# EAGLE design Rocketry_circuit (EAGLE 9.6.2)
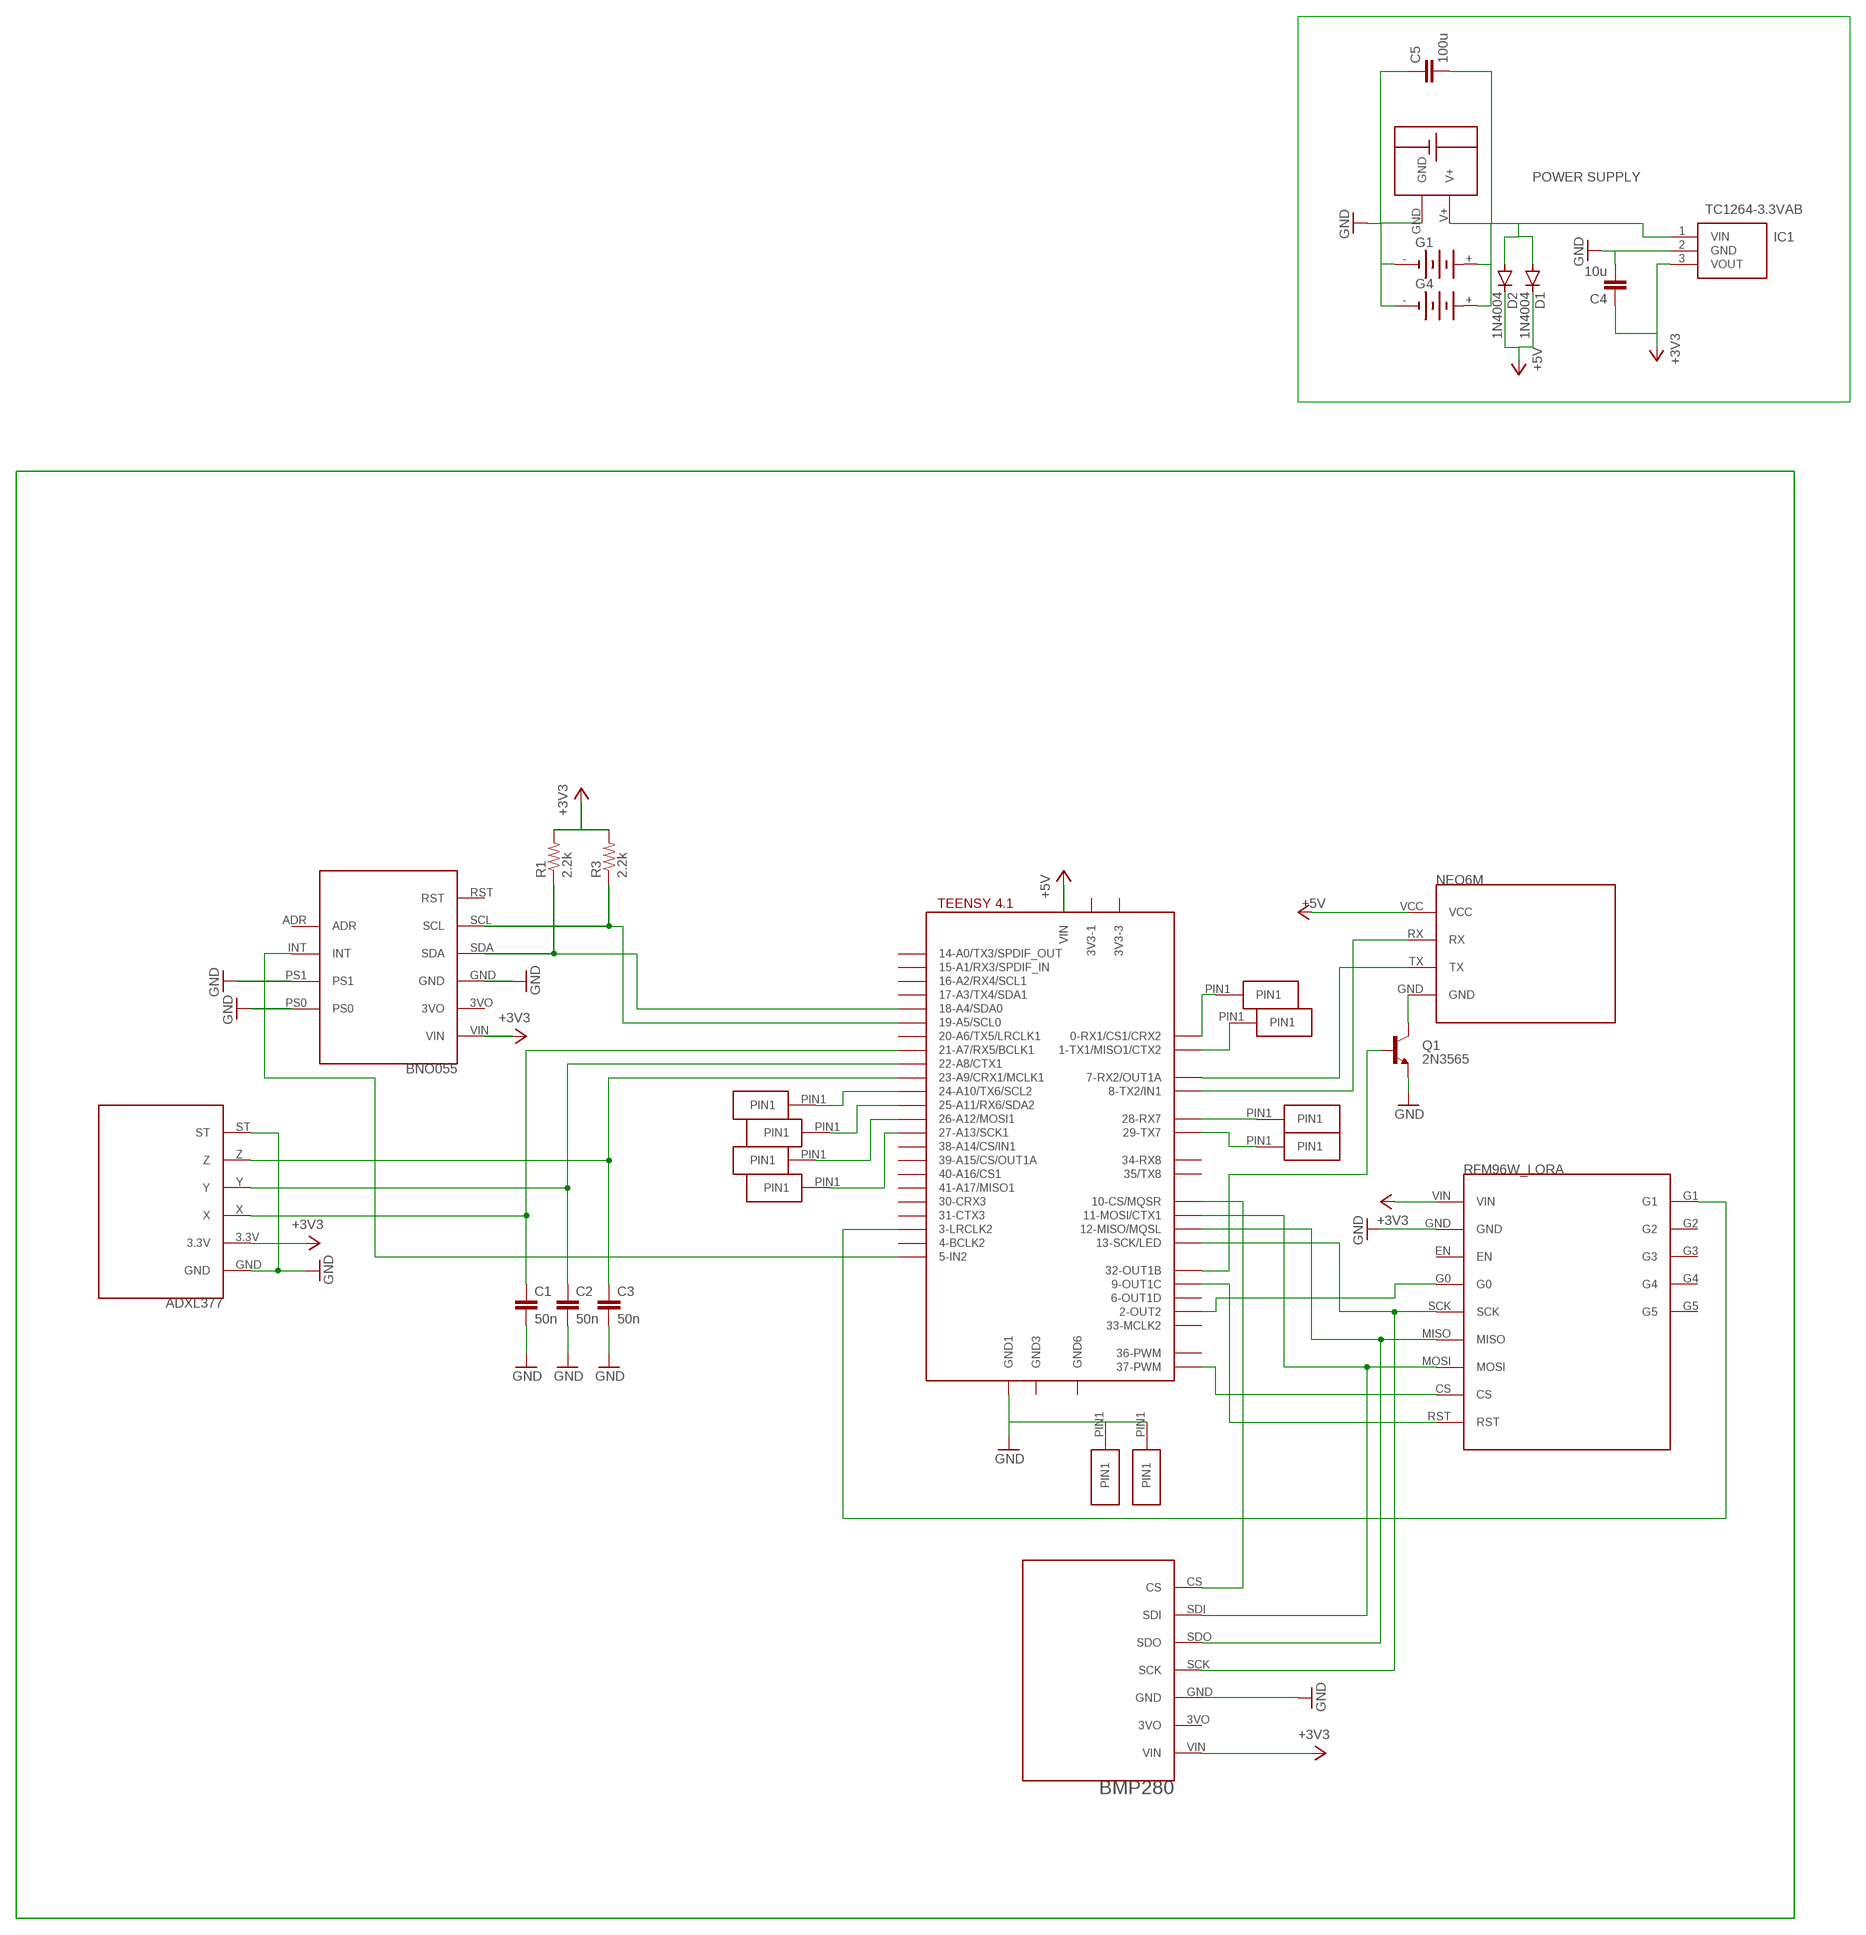
[diagram p0: schematic, sheet 1]

## Parts
BRKOUT1  BNO055  [BNO055]
C1  50n  C2,5-3  [C2.5-3]
C2  50n  C2,5-3  [C2.5-3]
C3  50n  C2,5-3  [C2.5-3]
C4  10u  C2,5-3  [C2.5-3]
C5  100u  C2,5-3  [C2.5-3]
D1  1N4004  [DO41-10]
D2  1N4004  [DO41-10]
G1  3V11R  [3V11R]
G4  3V11R  [3V11R]
IC1  TC1264-3.3VAB  [TO254P483X988X2222-3P]
Q1  2N3565  [TO92]
R1  2.2k  R-US_0207/5V  [0207/5V]
R3  2.2k  R-US_0207/5V  [0207/5V]
U$1  TEENSY41  [TEENSY41]
U$2  BMP280  [BMP280]
U$3  ADXL377  [ADXL377]
U$4  NEO6M  [NEO6M]
U$5  RFM96W  [RFM96W]
U$6  1PINOUT  [1PINOUT]
U$7  1PINOUT  [1PINOUT]
U$8  1PINOUT  [1PINOUT]
U$9  1PINOUT  [1PINOUT]
U$10  1PINOUT  [1PINOUT]
U$11  1PINOUT  [1PINOUT]
U$12  SMALL_SCREW_TERMINAL  [SMALL_SCREW_TERMINAL]
U$13  1PINOUT  [1PINOUT]
U$14  1PINOUT  [1PINOUT]
U$15  1PINOUT  [1PINOUT]
U$16  1PINOUT  [1PINOUT]

## Nets
+3V3: BRKOUT1.VIN C4.1 IC1.3(VOUT) R1.2 R3.2 U$2.VIN U$3.3.3V U$5.VIN
+5V: D1.C D2.C U$1.VIN U$4.VCC
GND: BRKOUT1.GND BRKOUT1.PS0 BRKOUT1.PS1 C1.2 C2.2 C3.2 C4.2 C5.1 G1.- G4.- IC1.2(GND) Q1.3(E) U$1.GND1 U$2.GND U$3.GND U$3.ST U$5.GND U$10.PIN1 U$11.PIN1 U$12.GND
N$1: C1.1 U$1.21-A7/RX5/BCLK1 U$3.X
N$2: C2.1 U$1.22-A8/CTX1 U$3.Y
N$3: BRKOUT1.SDA R1.1 U$1.18-A4/SDA0
N$4: C3.1 U$1.23-A9/CRX1/MCLK1 U$3.Z
N$5: BRKOUT1.SCL R3.1 U$1.19-A5/SCL0
N$6: U$1.7-RX2/OUT1A U$4.TX
N$7: U$1.8-TX2/IN2(8-TX2/IN1) U$4.RX
N$8: U$1.13-SCK/LED U$2.SCK U$5.SCK
N$9: U$1.12-MISO/MQSL U$2.SDO U$5.MISO
N$10: U$1.11-MOSI/CTX1 U$2.SDI U$5.MOSI
N$11: U$1.37-PWM U$5.CS
N$12: C5.2 D1.A D2.A G1.+ G4.+ IC1.1(VIN) U$12.V+
N$13: BRKOUT1.INT U$1.5-IN2
N$14: U$1.2-OUT2 U$5.G0
N$15: U$1.24-A10/TX6/SCL2 U$9.PIN1
N$16: U$1.10-CS\MQSR(10-CS/MQSR) U$2.CS
N$17: U$1.25-A11/RX6/SDA2 U$7.PIN1
N$18: U$1.28-RX7 U$6.PIN1
N$19: U$1.3-LRCLK2 U$5.G1
N$20: U$1.9-OUT1C U$5.RST
N$21: U$1.29-TX7 U$8.PIN1
N$22: U$1.26-A12/MOSI1 U$13.PIN1
N$23: Q1.2(B) U$1.32-OUT1B
N$24: Q1.1(C) U$4.GND
N$25: U$1.27-A13/SCK1 U$14.PIN1
N$26: U$1.0-RX1/CS1/CRX2 U$15.PIN1
N$27: U$1.1-TX1/MISO1/CTX2 U$16.PIN1
Unconnected: BRKOUT1.3VO BRKOUT1.ADR BRKOUT1.RST U$1.3V3-1 U$1.3V3-3 U$1.4-BCLK2 U$1.6-OUT1D U$1.14-A0/TX3/SPDIF_OUT U$1.15-A1/RX3/SPDIF_IN U$1.16-A2/RX4/SCL1 U$1.17-A3/TX4/SDA1 U$1.20-A6/TX5/LRCLK1 U$1.30-CRX3 U$1.31-CTX3 U$1.33-MCLK2 U$1.34-RX8 U$1.35-TX8(35/TX8) U$1.36-PWM U$1.38-A14/CS/IN1 U$1.39-A15/CS/OUT1A U$1.40-A16/CS1 U$1.41-A17/MISO1 U$1.GND3 U$1.GND6 U$2.3VO U$5.EN U$5.G2 U$5.G3 U$5.G4 U$5.G5

## Notes on the sheet
- POWER SUPPLY

## Library data of the parts
BRKOUT1 = BNO055:BNO055: A BNO055 breakout board by adafruit
C1-C5 = capacitor-wima:C: CAPACITOR naming: grid - package width
D1 D2 = diode:1N4004: DIODE general purpose rectifier, 1 A
G1 G4 = battery:3V11R: NC ACCU Varta
IC1 = TC1264-3.3VAB:TC1264-3.3VAB: LDO Regulator 3.3V 800mA Shutdown TO220 Microchip TC1264-3.3VAB, LDO Voltage Regulator, 800mA, 3.3 V +/-0.5%, 2.7 6 Vin, 3-Pin TO-220 Source: Datasheet <http://uk.rs-online.com/web/p/products/7747655>; ARROW_PART_NUMBER: TC1264-3.3VAB; ARROW_PRICE-STOCK: https://www.arrow.com/en/products/tc1264-3.3vab/microchip-technology; DESCRIPTION: LDO Regulator 3.3V 800mA Shutdown TO220 Microchip TC1264-3.3VAB, LDO Voltage Regulator, 800mA, 3.3 V +/-0.5%, 2.7 6 Vin, 3-Pin TO-220; HEIGHT: 4.826mm; MANUFACTURER_NAME: Microchip; MANUFACTURER_PART_NUMBER: TC1264-3.3VAB; MOUSER_PART_NUMBER: 579-TC1264-3.3VAB; MOUSER_PRICE-STOCK: https://www.mouser.co.uk/ProductDetail/Microchip-Technology/TC1264-33VAB?qs=Q7Ie0ohxq4vmR2G7dktayw%3D%3D
Q1 = transistor-npn:2N3565: NPN Transistor
R1 R3 = adafruit:R-US_: RESISTOR, American symbol
U$1 = teensy:TEENSY41
U$2 = BMP280:BMP280
U$3 = ADXL377:ADXL377
U$4 = NEO6M:NEO6M
U$5 = RMF96W_lora:RFM96W
U$6-U$11 U$13-U$16 = 1PINOUT:1PINOUT
U$12 = SMALL_SCREW_TERMINAL:SMALL_SCREW_TERMINAL

## Board
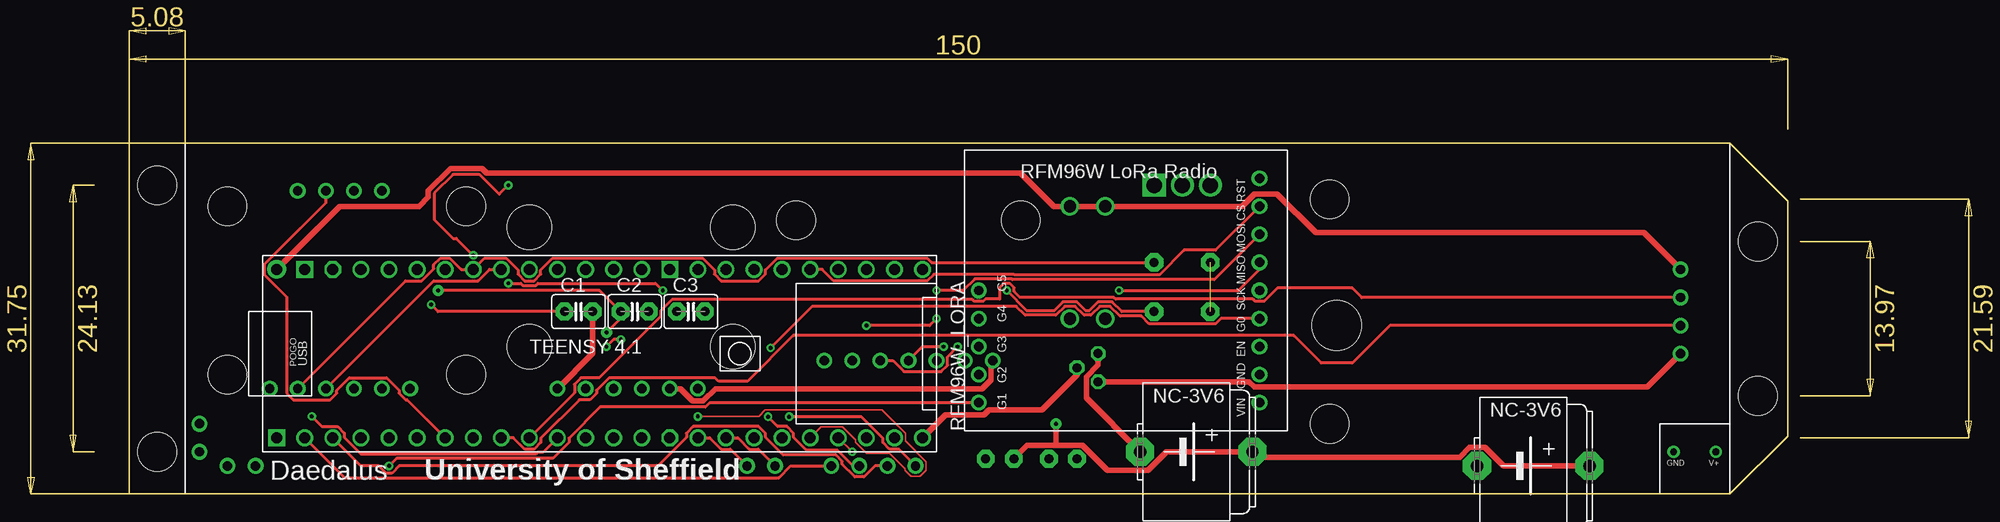
[diagram p1: board, top side]
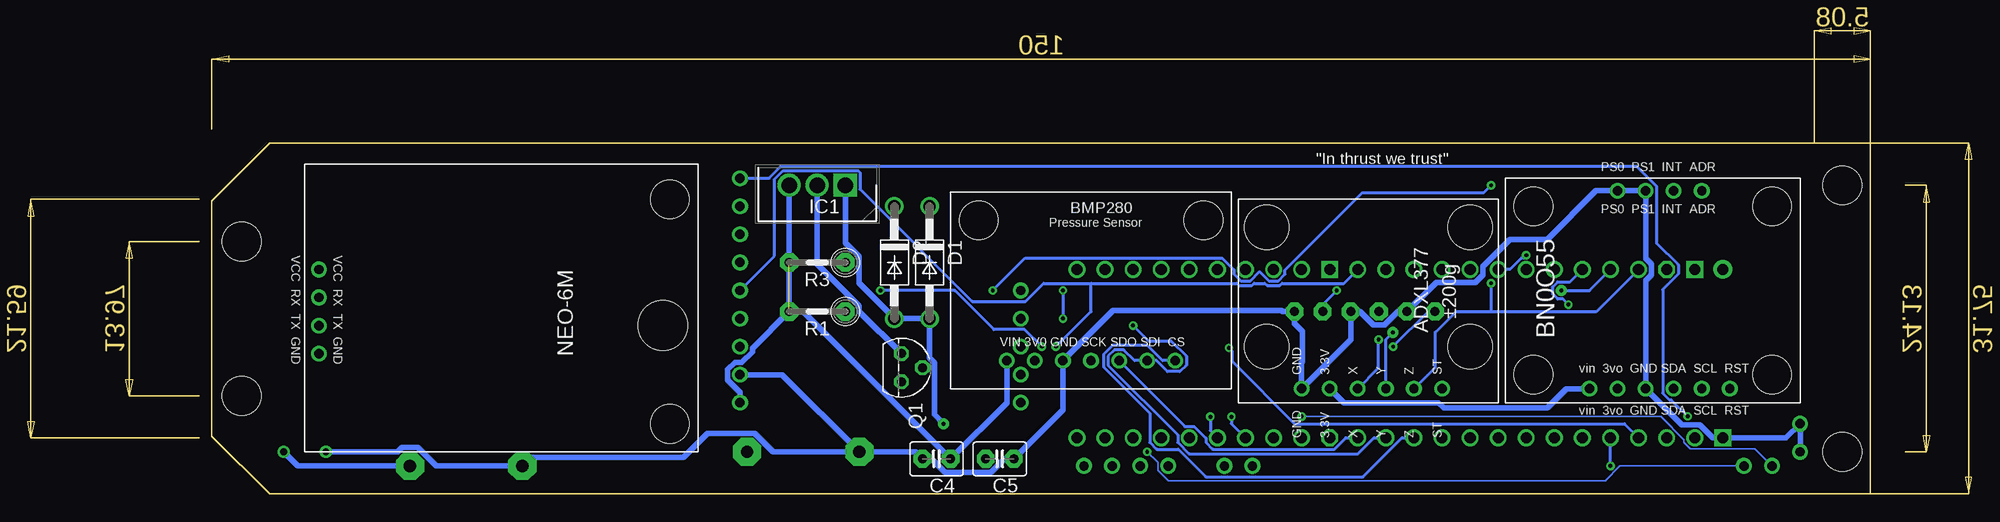
[diagram p2: board, bottom side, seen from below]

Size 150 x 31.75 mm. Coordinates in mm from the lower left corner, seen from the top.
Outline: 0,0 0,31.75 144.78,31.75 150,26.53 150,5.22 144.78,0 0,0
Copper layers (1*16): Top 0.035mm / dielectric 1.5mm / Bottom 0.035mm
Design rules "default": minimum track width 6mil, minimum drill 0.35mm, track to track 6mil, track to pad 6mil, pad to pad 6mil, via to via 6mil, smd to smd 6mil, copper to edge 40mil, drill to drill 6mil, minimum pad ring 10mil, minimum via ring 8mil, stop-mask expansion 4mil, vias tented up to drill 0mil, thermal gap 10mil
Holes 3.5 mm at 2.54,27.94 2.54,3.81 147.32,22.86 147.32,8.89

### Footprints (pad centres in the part's own frame; a part is rotated, then mirrored left to right if it is on the bottom)
BNO055 = drill 0.85 pad 1.422: 3VO 1.27,16.51; ADR 19.19,8.89; GND 1.27,13.97; INT 19.19,11.43; PS0 19.19,16.51; PS1 19.19,13.97; RST 1.27,6.35; SCL 1.27,8.89; SDA 1.27,11.43; VIN 1.27,19.05 | hole 3.5: 2.54,24.13; 17.78,24.13; 2.54,2.54; 17.78,2.54
C2.5-3 = drill 0.813 pad 1.6 octagon: 1 -1.27,0; 2 1.27,0
DO41-10 = drill 1.118: A 5.08,0; C -5.08,0
3V11R = drill 1.118 pad 2.54 octagon: + -5.08,0; - 5.08,0
TO254P483X988X2222-3P = drill 1.39 pad 2.085 square: 1 0,0 | drill 1.39 pad 2.085: 2 2.54,0; 3 5.08,0
TO92 = drill 0.813 octagon: 1 1.27,0; 2 0,1.905; 3 -1.27,0
0207/5V = drill 0.813 pad 1.676 octagon: 1 -2.54,0; 2 2.54,0
TEENSY41 = drill 1: 0-RX1/CS1/CRX2 -27.94,-7.62; 1-TX1/MISO1/CTX2 -25.4,-7.62; 2-OUT2 -22.86,-7.62; 3-LRCLK2 -20.32,-7.62; 4-BCLK2 -17.78,-7.62; 5-IN2 -15.24,-7.62; 6-OUT1D -12.7,-7.62; 7-RX2/OUT1A -10.16,-7.62; 8-TX2/IN2 -7.62,-7.62; 9-OUT1C -5.08,-7.62; 10-CS\MQSR -2.54,-7.62; 11-MOSI/CTX1 0,-7.62; 12-MISO/MQSL 2.54,-7.62; 13-SCK/LED 2.54,7.62; 14-A0/TX3/SPDIF_OUT 0,7.62; 15-A1/RX3/SPDIF_IN -2.54,7.62; 16-A2/RX4/SCL1 -5.08,7.62; 17-A3/TX4/SDA1 -7.62,7.62; 18-A4/SDA0 -10.16,7.62; 19-A5/SCL0 -12.7,7.62; 20-A6/TX5/LRCLK1 -15.24,7.62; 21-A7/RX5/BCLK1 -17.78,7.62; 22-A8/CTX1 -20.32,7.62; 23-A9/CRX1/MCLK1 -22.86,7.62; 24-A10/TX6/SCL2 7.62,-7.62; 25-A11/RX6/SDA2 10.16,-7.62; 26-A12/MOSI1 12.7,-7.62; 27-A13/SCK1 15.24,-7.62; 28-RX7 17.78,-7.62; 29-TX7 20.32,-7.62; 30-CRX3 22.86,-7.62; 31-CTX3 25.4,-7.62; 32-OUT1B 27.94,-7.62; 33-MCLK2 27.94,7.62; 34-RX8 25.4,7.62; 35-TX8 22.86,7.62; 36-PWM 20.32,7.62; 37-PWM 17.78,7.62; 38-A14/CS/IN1 15.24,7.62; 39-A15/CS/OUT1A 12.7,7.62; 40-A16/CS1 10.16,7.62; 41-A17/MISO1 7.62,7.62 | drill 1 octagon: 3V3-1 5.08,-7.62; 3V3-3 -25.4,7.62 | drill 1 square: GND1 -30.48,-7.62; GND3 5.08,7.62; GND6 -27.94,7.62 | drill 1 pad 1.676: VIN -30.48,7.62
BMP280 = drill 0.85 pad 1.422: 3VO 2.54,17.78; CS 2.54,5.08; GND 2.54,15.24; SCK 2.54,12.7; SDI 2.54,7.62; SDO 2.54,10.16; VIN 2.54,20.32 | hole 3.5: 15.24,22.86; 15.24,2.54
ADXL377 = drill 0.85 pad 1.422: 3.3V 1.27,15.24; GND 1.27,17.78; ST 1.27,5.08; X 1.27,12.7; Y 1.27,10.16; Z 1.27,7.62 | hole 4: 5.08,20.955; 15.875,20.955; 15.875,2.54; 5.08,2.54
NEO6M = drill 0.85 pad 1.422: GND 1.27,8.89; RX 1.27,13.97; TX 1.27,11.43; VCC 1.27,16.51 | hole 3.5: 33.02,2.54; 33.02,22.86 | hole 4.5: 32.385,11.43
RFM96W = drill 0.85 pad 1.422: CS 20.32,2.54; EN 7.62,2.54; G0 10.16,2.54; G1 2.54,27.94; G2 5.08,27.94; G3 7.62,27.94; G4 10.16,27.94; G5 12.7,27.94; GND 5.08,2.54; MISO 15.24,2.54; MOSI 17.78,2.54; RST 22.86,2.54; SCK 12.7,2.54; VIN 2.54,2.54
1PINOUT = drill 0.85 pad 1.422: PIN1 0,0
SMALL_SCREW_TERMINAL = drill 0.6: GND 1.27,3.81; V+ 5.08,3.81

### Placement (x,y rotation side)
BRKOUT1  6.35,8.26 90 bottom
C1  40.64,16.51 0 top
C2  45.72,16.51 0 top
C3  50.8,16.51 0 top
C4  84.45,3.17 180 bottom
C5  78.74,3.17 180 bottom
D1  85.09,20.95 270 bottom
D2  88.27,20.95 270 bottom
G1  127,2.54 180 top
G4  96.52,3.81 180 top
IC1  92.71,27.94 180 bottom
Q1  87.63,11.43 270 bottom
R1  95.25,16.51 180 bottom
R3  95.25,20.95 180 bottom
U$1  43.81,12.7 0 top
U$2  57.78,9.53 90 bottom
U$3  33.66,8.26 90 bottom
U$4  141.6,3.81 0 bottom
U$5  104.78,5.71 90 top
U$6  8.89,2.54 0 top
U$7  58.42,2.54 0 top
U$8  11.43,2.54 0 top
U$9  55.88,2.54 0 top
U$10  6.35,3.81 0 top
U$11  6.35,6.35 0 top
U$12  138.43,0 0 top
U$13  66.04,2.54 0 top
U$14  71.12,2.54 0 top
U$15  63.5,2.54 0 top
U$16  68.58,2.54 0 top

### Tracks (layer width: path | path; a pad name or v marks a point on that pad's centre or on a via)
+3V3  (1 unrouted)
  Top 0.508: U$2.VIN 77.95,11.91 77.95,10.33 77.15,9.53 53.02,9.53 51.9,8.41 50.97,8.41 49.85,9.53 U$3.3.3V
  Bottom 0.508: IC1.3 R1.2 | R1.2 101.12,13.18 101.12,12.87 102.08,11.91 102.7,11.91 103.35,11.26 103.35,10.33 102.23,9.21 U$5.VIN | U$2.VIN 78.11,8.26 C4.1 96.52,16.51 R1.2 | BRKOUT1.VIN 27.48,9.53 29.23,7.78 38.57,7.78 39.05,8.26 47.62,8.26 U$3.3.3V
+5V
  Top 0.508: U$4.VCC 137,23.65 107.33,23.65 103.83,27.15 101.77,27.15 100.65,26.04 D2.C D1.C 83.65,26.04 80.63,29.05 32.31,29.05 31.9,29.46 29.06,29.46 27.05,27.45 27.05,26.88 26.21,26.04 19.05,26.04 U$1.VIN
GND
  Top 0.508: Q1.3 87.63,11.67 86.56,10.6 86.56,8.69 G4.- | C1.2 41.91,12.7 U$3.ST
  Bottom 0.508: Q1.3 91.47,16.54 91.47,17.03 95.25,20.81 IC1.2 | G4.- 98.42,10.79 U$5.GND | G4.- 99.23,3.81 100.91,5.49 105.18,5.49 107.33,3.33 121.13,3.33 G1.- 129.71,2.54 131.39,4.22 132.77,4.22 133.18,3.81 U$12.GND | U$10.PIN1 U$11.PIN1 7.62,5.08 U$1.GND1 14.23,5.08 15.39,6.24 17.04,6.24 BRKOUT1.GND 20.32,19.31 19.8,19.84 19.8,20.8 20.32,21.33 BRKOUT1.PS1 BRKOUT1.PS0 24.8,27.45 29.23,23.02 32.6,23.02 35.03,20.58 35.03,19.84 35.71,19.16 39.26,19.16 C1.2 42.74,16.51 43.95,15.3 44.95,15.3 46.16,16.51 C2.2 46.99,13.97 U$3.GND 51.44,11.89 51.34,11.98 51.34,14.69 52.07,15.42 C3.2 53.16,16.51 53.26,16.61 68.48,16.61 U$2.GND 73.03,7.62 C5.1 78.3,3.17 79.51,1.97 83.69,1.97 84.89,3.17 C4.2 86.36,3.81 G4.-
N$1  (via drill 0.35 pad 0.75)
  Top 0.254: v44.47,13.97 43.79,13.97 v43.16,13.34 | C1.1 27.94,16.51 v27.3,17.14
  Bottom 0.254: U$3.X 44.47,11.41 v44.47,13.97 | v43.16,13.34 39.98,16.51 C1.1 | U$1.21-A7/RX5/BCLK1 27.16,19.19 28.26,19.19 28.72,18.74 28.72,18.09 28.26,17.64 27.8,17.64 v27.3,17.14
N$2  (via drill 0.35 pad 1)
  Top 0.254: v43.18,14.61 44.45,15.88 C2.1 42.55,18.41 v27.94,18.41
  Bottom 0.254: U$3.Y 43.81,13.97 v43.18,14.61 | v27.94,18.41 25.4,18.41 U$1.22-A8/CTX1
N$3  (via drill 0.35 pad 0.75)
  Top 0.254: BRKOUT1.SDA 27.54,19.29 31.54,19.29 32.58,20.32 U$1.18-A4/SDA0 | v79.38,18.41 81.2,16.59 83.65,16.59 84.46,17.4 85.72,17.4 86.53,16.59 86.82,16.59 87.63,17.4 88.9,17.4 89.78,16.51 R1.1 | v34.29,27.94 33.48,27.13 31.68,28.93 29.28,28.93 27.59,27.23 27.59,24.84 29.28,23.14 29.58,23.14 v31.11,21.61
  Bottom 0.254: v79.38,18.41 76.44,21.35 58.63,21.35 57.55,20.27 57.55,19.89 56.94,19.29 56.09,19.29 55.24,20.13 54.4,19.29 53.55,19.29 52.94,19.89 52.94,20.27 45.94,27.27 34.96,27.27 v34.29,27.94 | v31.11,21.61 31.37,21.35 31.54,21.35 32.58,20.32 U$1.18-A4/SDA0
N$4  (via drill 0.35 pad 0.75)
  Top 0.254: v48.26,18.41 47.6,19.07 36.98,19.07 36.79,18.88 35.6,18.88 35.41,19.07 v34.29,19.07
  Bottom 0.254: U$1.23-A9/CRX1/MCLK1 24.8,16.48 34.29,16.48 | 34.29,16.48 37.5,16.48 39.34,14.64 39.34,11.46 U$3.Z | 34.29,16.48 v34.29,19.07 | v48.26,18.41 49.53,17.14 C3.1
N$5
  Top 0.254: BRKOUT1.SCL 25,19.29 26.46,19.29 27.54,20.36 27.54,20.75 28.15,21.35 29,21.35 30.04,20.32 U$1.19-A5/SCL0 32.15,21.35 34.08,21.35 35.16,20.27 35.16,19.89 35.77,19.29 36.62,19.29 37.23,19.89 37.23,20.27 38.31,21.35 51.86,21.35 52.94,20.27 52.94,19.89 53.55,19.29 56.94,19.29 57.55,19.89 57.55,20.27 58.63,21.35 72.18,21.35 72.58,20.95 R3.1
N$6
  Top 0.254: U$4.TX 114.02,15.24 110.62,11.85 107.81,11.85 105.34,14.33 60.05,14.33 55.91,10.19 53.31,10.19 52.98,10.52 43.41,10.52 42.27,9.38 42.27,9.12 41.69,8.53 40.73,8.53 37.23,5.04 37.23,4.65 36.62,4.05 35.77,4.05 34.73,5.08 U$1.7-RX2/OUT1A
N$7
  Top 0.254: U$4.RX 111.48,17.78 110.62,18.63 103.85,18.63 102.64,17.42 101.83,17.42 101.62,17.63 89.24,17.63 89.06,17.8 80.56,17.8 80.03,18.33 80.03,18.69 79.65,19.07 79.1,19.07 78.72,18.69 78.72,17.63 77.45,17.63 77.25,17.42 76.42,17.42 76.26,17.59 49.08,17.59 48.07,16.58 48.07,16.06 42.52,10.52 40.87,10.52 40.28,9.94 40.28,9.17 U$1.8-TX2/IN2
N$8  (via drill 0.35 pad 0.75)
  Top 0.254: U$2.SCK 71.75,13.34 v73.66,13.34
  Bottom 0.254: U$1.13-SCK/LED 47.6,19.07 53.19,19.07 53.38,18.88 54.57,18.88 54.76,19.07 55.73,19.07 55.92,18.88 57.11,18.88 57.3,19.07 70.48,19.07 | U$5.SCK 99.11,21.54 99.11,28.49 98.34,29.26 91.55,29.26 91.39,29.1 91.39,27.58 81.23,17.42 76.42,17.42 74.78,19.07 70.48,19.07 | v73.66,13.34 70.48,16.51 70.48,19.07
N$9  (via drill 0.35 pad 0.75)
  Top 0.254: v74.93,13.34 74.02,12.42 74.02,11.65 73.44,11.07 70.08,11.07 69.08,12.06 U$2.SDO | v89.53,18.41 100.33,18.41 102.23,20.32 U$5.MISO
  Bottom 0.254: U$2.SDO 61.99,6.11 61.17,6.11 60.09,5.04 60.09,4.65 59.48,4.05 48.47,4.05 47.43,5.08 U$1.12-MISO/MQSL | v74.93,13.34 76.48,14.88 79.27,14.88 82.8,18.41 v89.53,18.41
N$10  (via drill 0.35 pad 0.75)
  Top 0.254: v73.03,18.41 75.43,18.41 76.5,19.48 79.82,19.48 79.89,19.41 98.15,19.41 U$5.MOSI | v73.03,15.88 72.39,15.24 v66.67,15.24
  Bottom 0.254: U$1.11-MOSI/CTX1 44.89,5.08 46.33,3.64 61.62,3.64 62.63,4.65 62.63,5.35 68.94,11.65 68.94,12.47 68.36,13.06 67.53,13.06 66.54,12.06 U$2.SDI 64.58,12.06 63.59,11.07 62.45,11.07 61.87,11.65 61.87,12.47 63.27,13.87 65.3,13.87 v66.67,15.24 | v73.03,18.41 v73.03,15.88
N$11
  Top 0.254: U$5.CS 98.27,22.07 95.41,22.07 93.17,19.84 80.03,19.84 79.98,19.89 72.78,19.89 72.18,19.29 63.71,19.29 62.67,20.32 U$1.37-PWM
N$12  (via drill 0.35 pad 1)
  Top 0.508: G1.+ 124.29,2.54 122.61,4.22 121.23,4.22 120.34,3.33 102.08,3.33 G4.+ 93.81,3.81 92.13,2.13 88.47,2.13 86.22,4.38 83.82,4.38 | 83.82,4.38 81.22,4.38 C5.2 | v83.82,6.35 83.82,4.38
  Bottom 0.508: G1.+ 142.24,2.54 U$12.V+ | IC1.1 92.71,22.71 91.47,21.47 91.47,19.07 D2.A D1.A 85.09,12.3 84.66,11.87 84.66,7.19 v83.82,6.35
N$13
  Top 0.254: U$1.5-IN2 25.12,8.53 24.99,8.53 24.41,9.12 24.41,9.38 23.27,10.52 19.91,10.52 18.77,9.38 18.77,9.12 18.19,8.53 14.83,8.53 14.25,9.12 14.25,17.82 12.22,19.86 12.22,20.78 17.78,26.35 BRKOUT1.INT
N$14  (via drill 0.35 pad 0.75)
  Top 0.254: U$5.G0 98.74,15.88 98.25,15.39 92.25,15.39 91.54,16.1 89.62,16.1 88.73,16.99 87.8,16.99 86.99,16.18 86.37,16.18 85.55,16.99 84.63,16.99 83.81,16.18 81.03,16.18 80.22,16.99 61.78,16.99 v58,13.21
  Bottom 0.254: v58,13.21 57.75,12.96 57.75,12.03 52.07,6.35 22.23,6.35 U$1.2-OUT2
N$15
  Top 0.254: U$9.PIN1 54.37,4.05 53.55,4.05 52.51,5.08 U$1.24-A10/TX6/SCL2
N$16
  Bottom 0.254: U$1.10-CS\MQSR 42.35,5.08 45.88,1.55 60.1,1.55 62.6,4.05 64.56,4.05 65.17,4.65 65.17,7.31 69.34,11.49 69.34,12.64 68.52,13.46 65.4,13.46 64,12.06 U$2.CS
N$17
  Top 0.254: U$7.PIN1 56.91,4.05 56.09,4.05 55.05,5.08 U$1.25-A11/RX6/SDA2
N$18  (via drill 0.35)
  Top 0.152: v51.44,7.01 56.95,7.01 57.53,7.59 68.09,7.59 70.2,5.49 70.2,4.79 72.06,2.93 72.06,2.15 71.51,1.6 70.73,1.6 70.18,2.15 70.18,2.27 68.76,3.69 66.67,3.69 65.69,4.67 65.69,4.91 64.54,6.06 62.58,6.06 U$1.28-RX7
  Bottom 0.152: U$6.PIN1 10.45,4.1 16.28,4.1 16.86,4.67 16.86,4.91 18.95,7.01 v51.44,7.01
N$19  (via drill 0.35 pad 0.75)
  Top 0.254: U$5.G1 52.5,8.26 52.12,7.87 42.61,7.87 39.77,5.04 39.77,4.65 38.35,3.23 24.19,3.23 v23.5,2.54
  Bottom 0.254: v23.5,2.54 U$1.3-LRCLK2
N$20  (via drill 0.35 pad 0.75)
  Top 0.254: v16.51,7.03 17.42,6.11 18.84,6.11 19.45,5.51 19.45,5.12 20.93,3.64 36.79,3.64 36.96,3.81 37.47,3.81 U$1.9-OUT1C
  Bottom 0.254: v16.51,7.03 18.02,8.53 18.19,8.53 18.77,9.12 18.77,18.5 17.38,19.89 17.38,20.75 19.33,22.7 19.33,27.86 21.14,29.67 98.51,29.67 99.6,28.57 U$5.RST
N$21  (via drill 0.35)
  Top 0.152: v65.41,3.81 U$1.29-TX7
  Bottom 0.152: v65.41,3.81 64.44,2.85 64.44,2.15 63.48,1.19 23.98,1.19 22.64,2.54 U$8.PIN1
N$22  (via drill 0.35 pad 0.75)
  Top 0.254: v57.78,6.99 58.66,6.11 59.48,6.11 60.09,5.51 60.09,5.12 61.28,3.94 64.08,3.94 65.48,2.54 U$13.PIN1
  Bottom 0.254: v57.78,6.99 57.78,6.35 U$1.26-A12/MOSI1
N$23
  Top 0.508: U$1.32-OUT1B 73.81,7.14 77.3,7.14 77.78,7.62 82.55,7.62 85.72,10.79 Q1.2
N$24
  Top 0.508: Q1.1 101.29,10.16 101.77,9.68 137.31,9.68 U$4.GND
N$25  (via drill 0.35 pad 0.75)
  Top 0.254: U$14.PIN1 69.61,4.05 68.79,4.05 68.18,4.65 68.18,5.04 66.23,6.99 v59.69,6.99
  Bottom 0.254: v59.69,6.99 59.69,5.71 U$1.27-A13/SCK1
N$26
  Top 0.254: U$15.PIN1 59.82,2.54 58.76,1.48 19.48,1.48 U$1.0-RX1/CS1/CRX2
N$27
  Top 0.254: U$16.PIN1 67.44,2.54 66.45,1.55 65.63,1.55 64.49,2.69 64.49,2.95 63.91,3.53 59.14,3.53 57.55,5.12 57.55,5.51 56.94,6.11 51.01,6.11 50.4,5.51 50.4,5.12 47.82,2.54 24.43,2.54 23.77,1.88 23.22,1.88 22.57,2.54 20.95,2.54 U$1.1-TX1/MISO1/CTX2

### Text on the board
bPlace: "In thrust we trust"
tNames: Daedalus | University of Sheffield